# EasyEDA Pro project PocketTerminal_2025-09-03.epro, board PCB Rev1
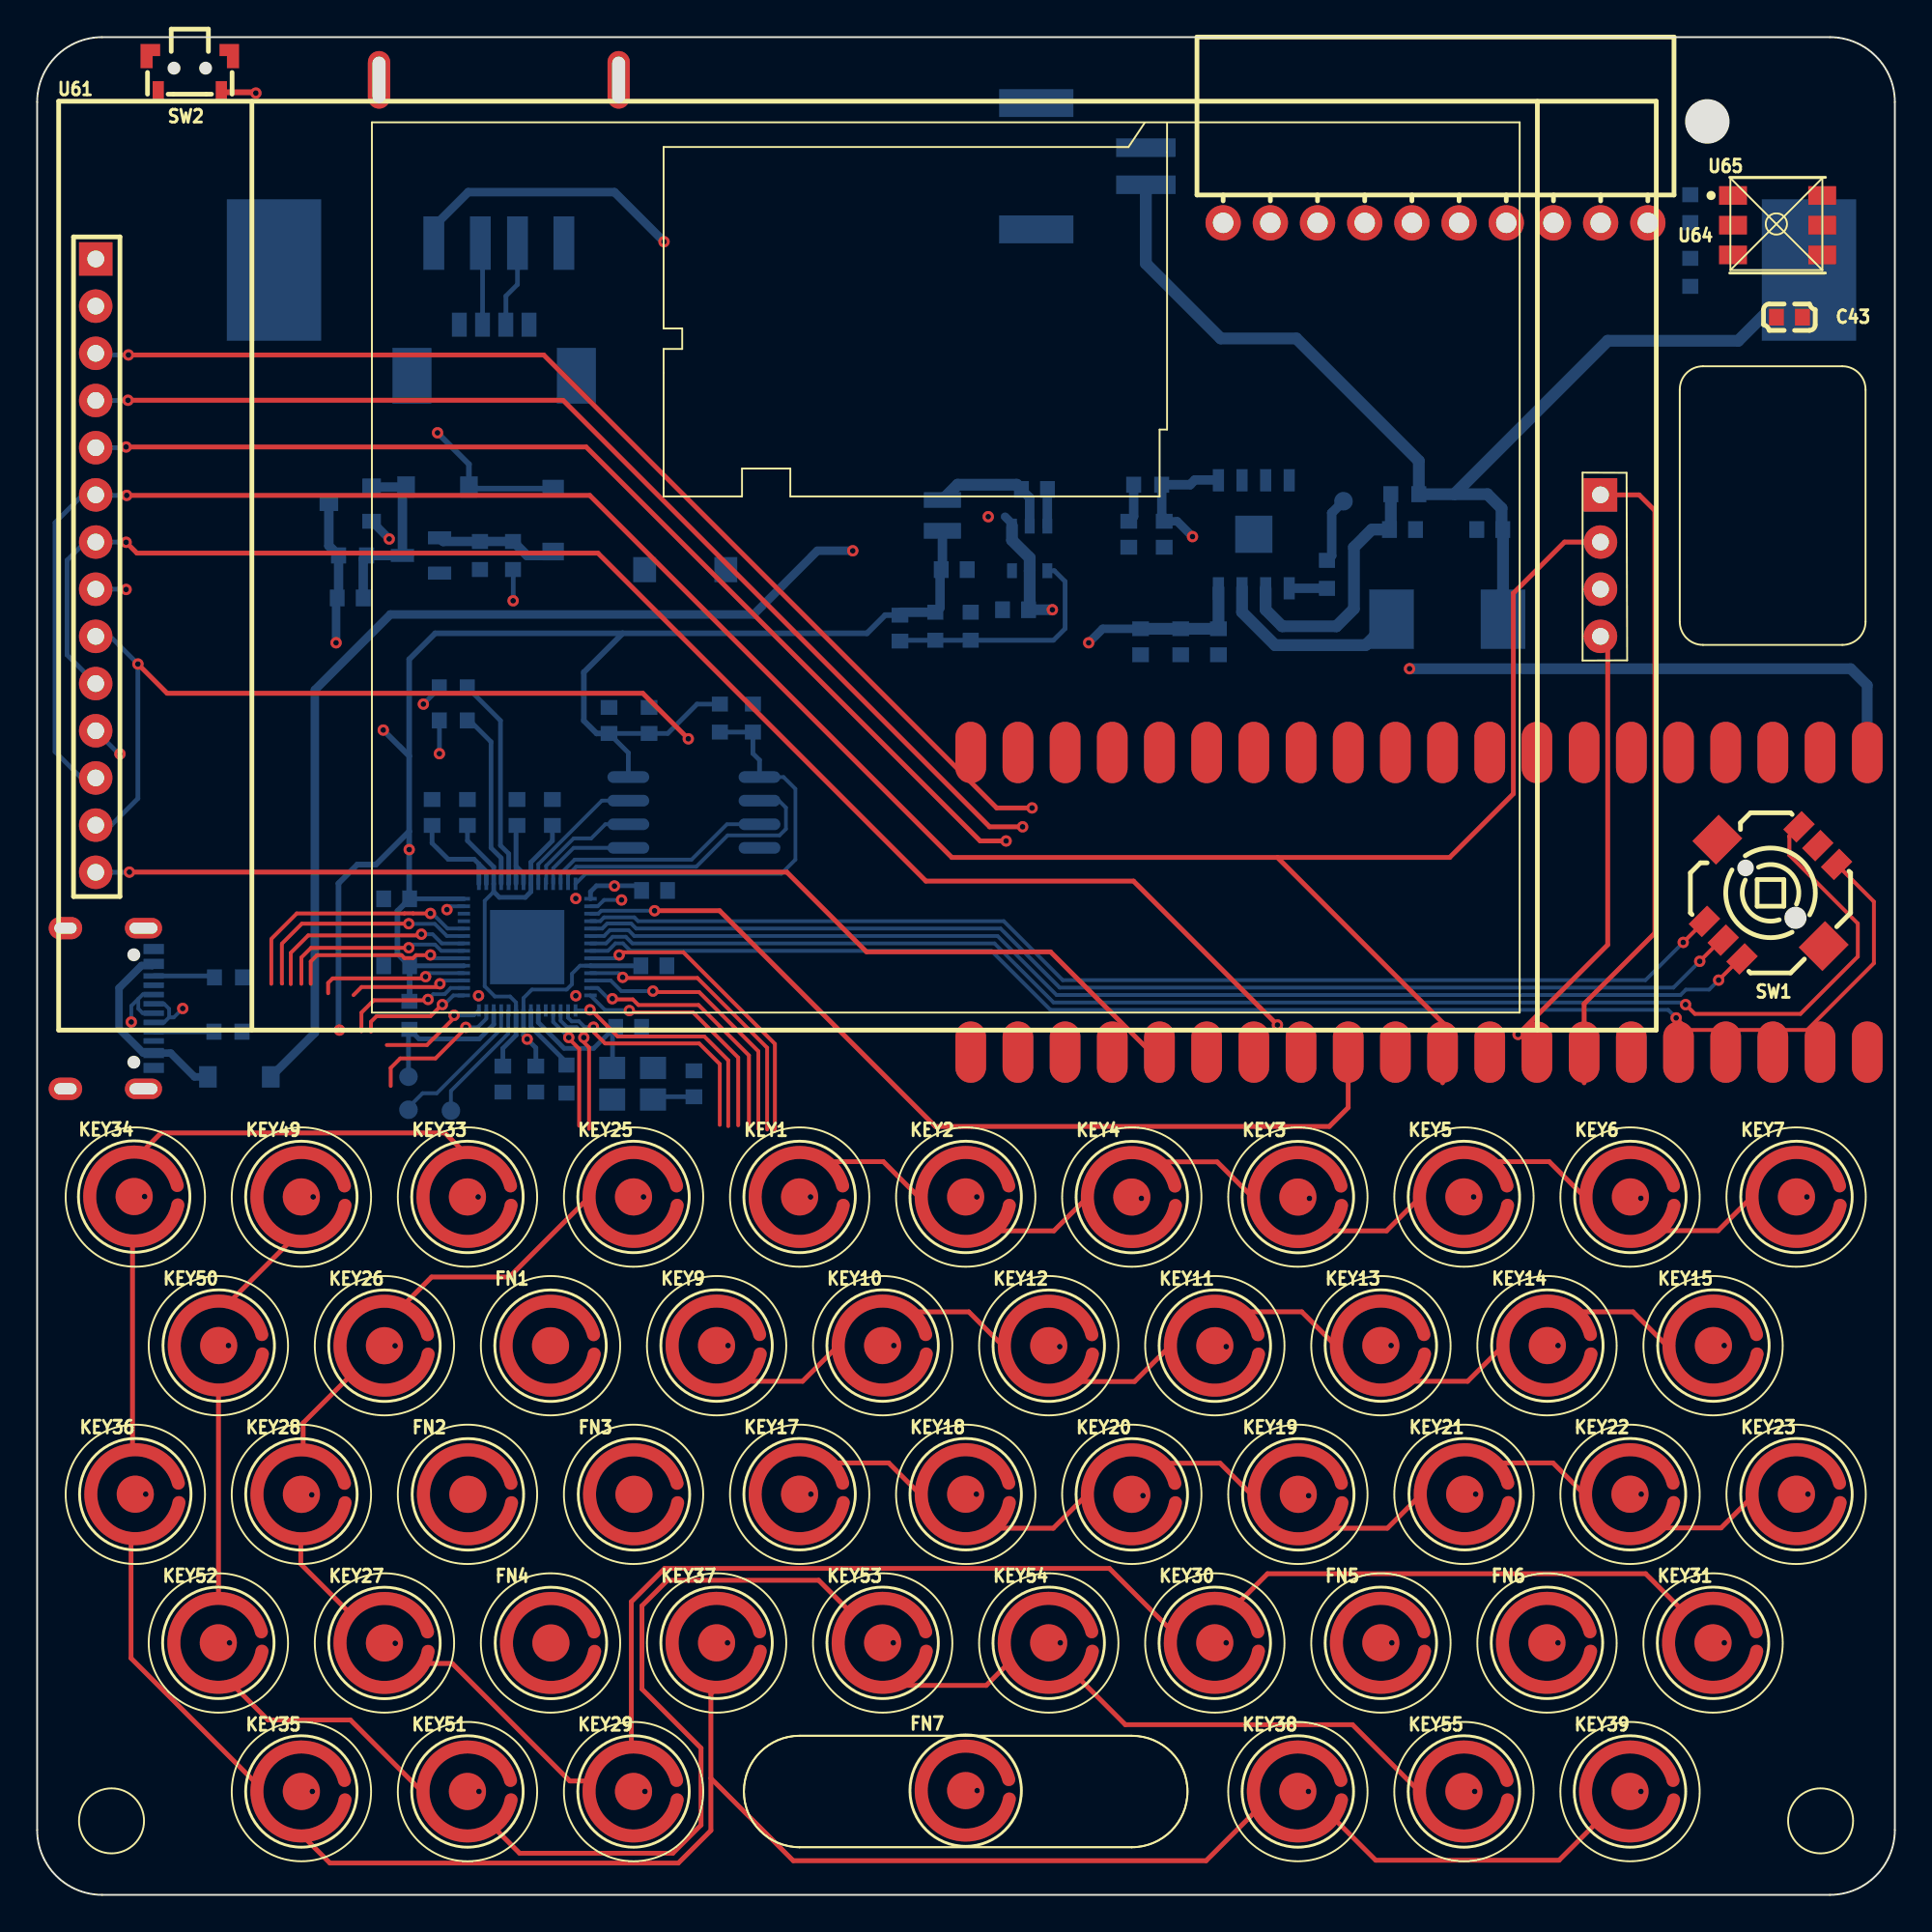
[diagram p1: board, top side]
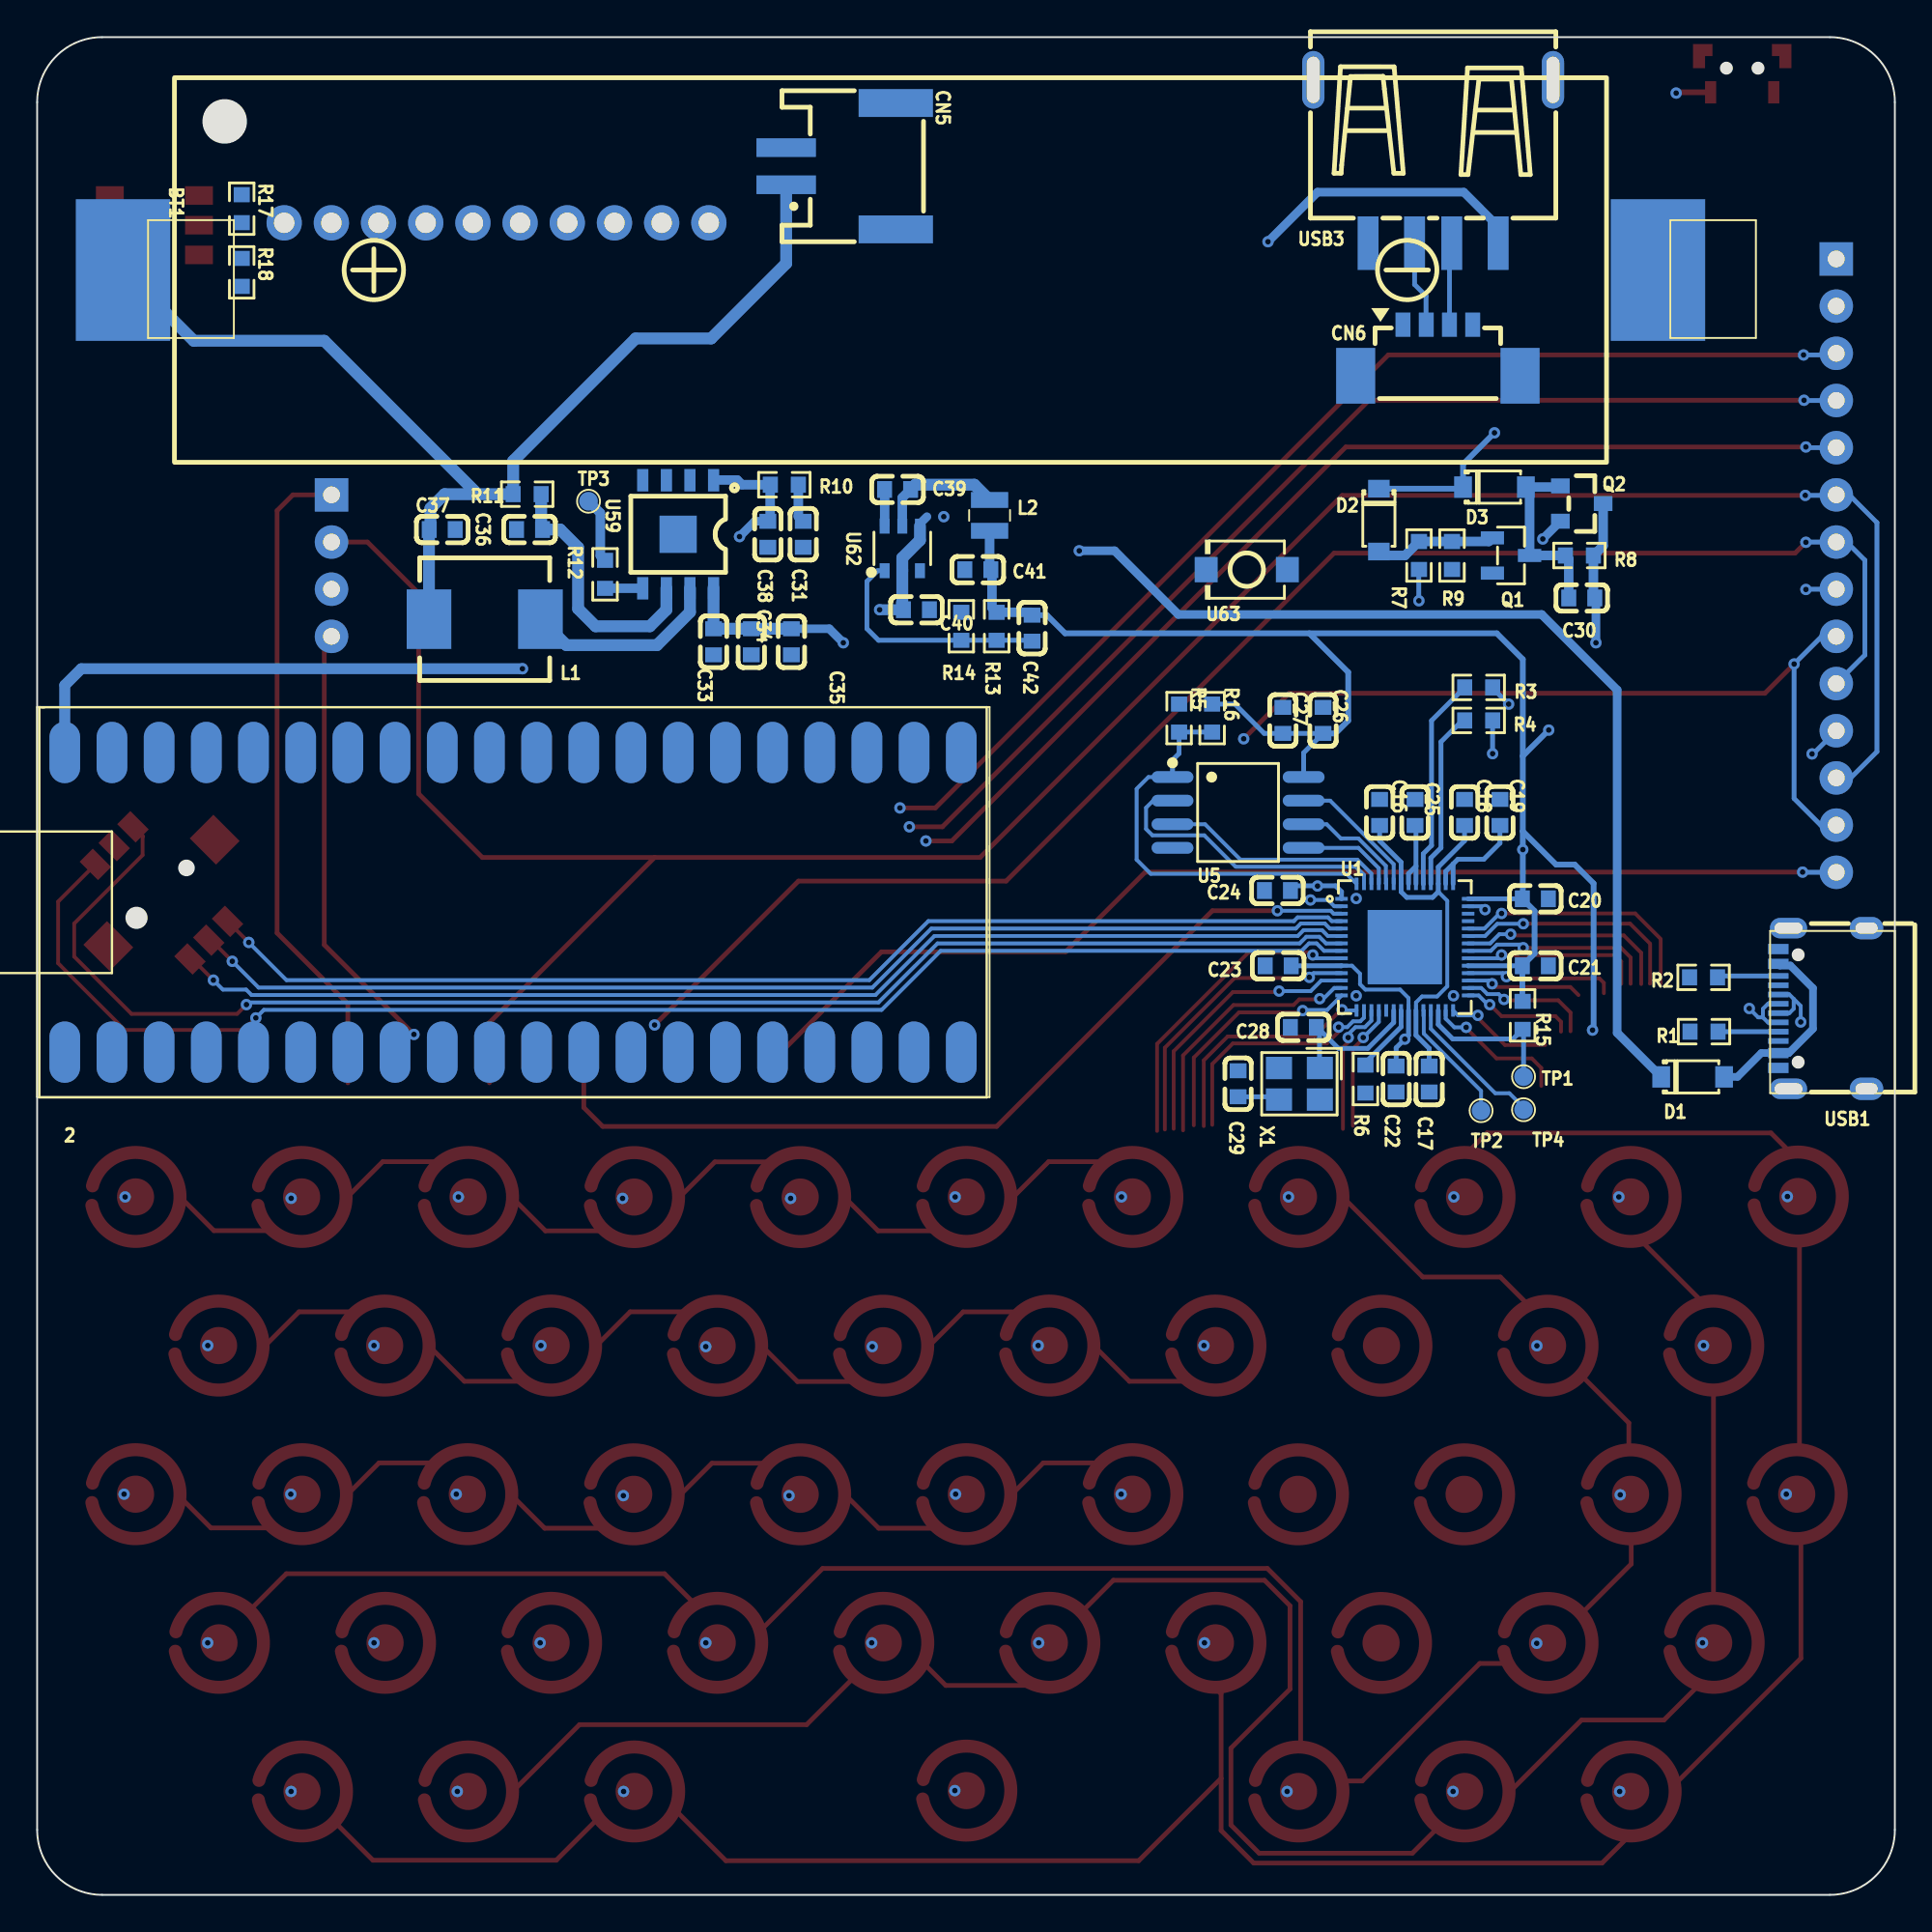
[diagram p2: board, bottom side, seen from below]

Outline 100 x 100 mm; copper layers: Top Layer, Inner1, Inner2, Bottom Layer. Coordinates in mm from the lower left corner of the outline.
Outline path: 0,96.5 0,3.5 arc(1.03,1.03) 3.5,0 96.5,0 arc(98.97,1.03) 100,3.5 100,96.5 arc(98.97,98.97) 96.5,100 3.5,100 arc(1.03,98.97) 0,96.5
Stack: Top Layer 0.035mm Outer layer thickness 1oz / Dielectric1 0.2104mm 7628 RC49% 8.6mil / Inner1 0.0152mm Inner layer thickness / Dielectric2 1.065mm 1.1mm H/HOZ Copper / Inner2 0.0152mm Inner layer thickness / Dielectric3 0.2104mm 7628 RC49% 8.6mil / Bottom Layer 0.035mm Outer layer thickness 1oz

## Design rules (mm)
template: JLCPCB Capability(Two Layers Board)
spacing copperThickness1oz (default): track to track 0.102, other pairs 0.152 to 0.3
spacing copperThickness2oz: track to track 0.203, other pairs 0.152 to 0.3
track width copperThickness1oz (default): min 0.127, default 0.254, max 2.54
track width copperThickness2oz: min 0.203, default 0.254, max 2.54
differential pair differentialPair (default): width min 0.127, default 0.254, max 2.54; gap min 0.152, default 0.152
via viaSize (default): diameter min 0.5, default 0.61, max 10; hole min 0.3, default 0.305, max 6.3

## Placement (name value [footprint] x y rotation side)
2  RASPBERRYPI-PICO  [RASPBERRYPIPICO]  98.51 44.54 180 bottom
BT1  BH-18650-B1BA002  [BATTERY-SMD_18650-1S-L77.1-W20.7-1]  54.06 87.47 90 bottom
C16  100nF  [C0603]  27.73 58.27 270 bottom
C17  100nF  [C0603]  25.07 43.91 90 bottom
C18  2.2uF  [C0603]  23.16 58.27 270 bottom
C19  2.2uF  [C0603]  21.26 58.27 270 bottom
C20  100nF  [C0603]  19.35 53.62 0 bottom
C21  100nF  [C0603]  19.35 50.01 0 bottom
C22  100nF  [C0603]  26.85 43.91 90 bottom
C23  100nF  [C0603]  33.2 50.01 180 bottom
C24  100nF  [C0603]  33.24 54.06 180 bottom
C25  100nF  [C0603]  25.83 58.27 270 bottom
C26  100nF  [C0603]  30.78 63.22 90 bottom
C27  2.2uF  [C0603]  32.94 63.22 90 bottom
C28  15pF  [C0603]  31.84 46.7 180 bottom
C29  15pF  [C0603]  35.35 43.66 270 bottom
C30  10nF  [C0603]  16.85 69.81 180 bottom
C31  10uF  [C0603]  58.76 73.24 90 bottom
C33  22uF  [C0603]  63.59 67.45 90 bottom
C34  22uF  [C0603]  61.56 67.45 90 bottom
C35  22uF  [C0603]  59.4 67.45 90 bottom
C36  22uF  [C0603]  73.5 73.5 180 bottom
C37  22uF  [C0603]  78.19 73.5 0 bottom
C38  10uF  [C0603]  60.67 73.24 270 bottom
C39  100nF  [C0603]  53.68 75.65 180 bottom
C40  10uF  [C0603]  52.67 69.18 0 bottom
C41  22uF  [C0603]  49.37 71.34 180 bottom
C42  47pF  [C0603]  46.44 68.19 90 bottom
C43  1nF  [C0603]  94.32 84.92 0 top
CN5  PH-2AWT  [CONN-SMD_PH-2AWT]  56.73 93.05 270 bottom
CN6  533980471  [CONN-SMD_4P-P1.25_533980471]  24.6 83.15 180 bottom
D1  LMBR120FT1G  [SOD-123_L2.8-W1.8-LS3.7-RD]  10.88 44.03 180 bottom
D2  LMBR120FT1G  [SOD-123_L2.8-W1.8-LS3.7-RD]  27.78 74 270 bottom
D3  LMBR120FT1G  [SOD-123_L2.8-W1.8-LS3.7-RD]  21.55 75.78 180 bottom
FN1  FN1  [KEY-SMD_BD5.0_600-508S-180]  26.44 29.52 0 top
FN2  FN2  [KEY-SMD_BD5.0_600-508S-180]  21.99 21.52 0 top
FN3  FN3  [KEY-SMD_BD5.0_600-508S-180]  30.93 21.52 0 top
FN4  FN4  [KEY-SMD_BD5.0_600-508S-180]  26.46 13.52 0 top
FN5  FN5  [KEY-SMD_BD5.0_600-508S-180]  71.14 13.53 0 top
FN6  FN6  [KEY-SMD_BD5.0_600-508S-180]  80.08 13.53 0 top
FN7  FN12  [KEY-SMD_BD5.0_600-508S-180]  48.79 5.57 0 top
KEY1  A1  [KEY-SMD_BD5.0_600-508S-180]  39.85 37.53 0 top
KEY2  B1  [KEY-SMD_BD5.0_600-508S-180]  48.79 37.53 0 top
KEY3  C1  [KEY-SMD_BD5.0_600-508S-180]  66.67 37.53 0 top
KEY4  D1  [KEY-SMD_BD5.0_600-508S-180]  57.73 37.53 0 top
KEY5  E1  [KEY-SMD_BD5.0_600-508S-180]  75.61 37.53 0 top
KEY6  F2  [KEY-SMD_BD5.0_600-508S-180]  84.57 37.53 0 top
KEY7  G1  [KEY-SMD_BD5.0_600-508S-180]  93.51 37.53 0 top
KEY9  A2  [KEY-SMD_BD5.0_600-508S-180]  35.38 29.53 0 top
KEY10  B1  [KEY-SMD_BD5.0_600-508S-180]  44.32 29.53 0 top
KEY11  C1  [KEY-SMD_BD5.0_600-508S-180]  62.2 29.52 0 top
KEY12  D1  [KEY-SMD_BD5.0_600-508S-180]  53.26 29.52 0 top
KEY13  E1  [KEY-SMD_BD5.0_600-508S-180]  71.14 29.53 0 top
KEY14  F2  [KEY-SMD_BD5.0_600-508S-180]  80.1 29.53 0 top
KEY15  G1  [KEY-SMD_BD5.0_600-508S-180]  89.04 29.53 0 top
KEY17  A3  [KEY-SMD_BD5.0_600-508S-180]  39.85 21.53 0 top
KEY18  B1  [KEY-SMD_BD5.0_600-508S-180]  48.79 21.53 0 top
KEY19  C1  [KEY-SMD_BD5.0_600-508S-180]  66.69 21.52 0 top
KEY20  D1  [KEY-SMD_BD5.0_600-508S-180]  57.73 21.52 0 top
KEY21  E1  [KEY-SMD_BD5.0_600-508S-180]  75.65 21.53 0 top
KEY22  F2  [KEY-SMD_BD5.0_600-508S-180]  84.55 21.53 0 top
KEY23  G1  [KEY-SMD_BD5.0_600-508S-180]  93.51 21.53 0 top
KEY25  A4  [KEY-SMD_BD5.0_600-508S-180]  30.91 37.53 0 top
KEY26  B1  [KEY-SMD_BD5.0_600-508S-180]  17.5 29.52 0 top
KEY27  C1  [KEY-SMD_BD5.0_600-508S-180]  17.5 13.52 0 top
KEY28  D1  [KEY-SMD_BD5.0_600-508S-180]  13.03 21.52 0 top
KEY29  E1  [KEY-SMD_BD5.0_600-508S-180]  30.91 5.53 0 top
KEY30  F2  [KEY-SMD_BD5.0_600-508S-180]  62.2 13.53 0 top
KEY31  G1  [KEY-SMD_BD5.0_600-508S-180]  89.02 13.53 0 top
KEY33  A5  [KEY-SMD_BD5.0_600-508S-180]  21.97 37.53 0 top
KEY34  B1  [KEY-SMD_BD5.0_600-508S-180]  4.03 37.55 0 top
KEY35  C1  [KEY-SMD_BD5.0_600-508S-180]  13.03 5.53 0 top
KEY36  D1  [KEY-SMD_BD5.0_600-508S-180]  4.09 21.53 0 top
KEY37  E1  [KEY-SMD_BD5.0_600-508S-180]  35.38 13.53 0 top
KEY38  F2  [KEY-SMD_BD5.0_600-508S-180]  66.67 5.53 0 top
KEY39  G1  [KEY-SMD_BD5.0_600-508S-180]  84.55 5.53 0 top
KEY49  A6  [KEY-SMD_BD5.0_600-508S-180]  13.03 37.53 0 top
KEY50  B1  [KEY-SMD_BD5.0_600-508S-180]  8.58 29.53 0 top
KEY51  C1  [KEY-SMD_BD5.0_600-508S-180]  21.97 5.53 0 top
KEY52  D1  [KEY-SMD_BD5.0_600-508S-180]  8.56 13.53 0 top
KEY53  E1  [KEY-SMD_BD5.0_600-508S-180]  44.32 13.53 0 top
KEY54  F2  [KEY-SMD_BD5.0_600-508S-180]  53.26 13.53 0 top
KEY55  G1  [KEY-SMD_BD5.0_600-508S-180]  75.61 5.53 0 top
L1  1uH  [IND-SMD_L7.0-W6.6]  75.91 68.67 0 bottom
L2  4.7uH  [IND-SMD_L2.5-W2.0-VLS252012CX-150M]  48.73 74.26 270 bottom
Q1  AO3400A  [SOT-23-3_L2.9-W1.3-P1.90-LS2.4-BR]  20.66 72.1 0 bottom
Q2  AO3401A  [SOT-23_L2.9-W1.3-P1.90-LS2.4-BR]  16.85 74.89 0 bottom
R1  5.1kΩ  [R0603]  10.27 46.47 180 bottom
R2  5.1kΩ  [R0603]  10.3 49.39 180 bottom
R3  27Ω  [R0603]  22.4 65 180 bottom
R4  27Ω  [R0603]  22.4 63.22 180 bottom
R5  1kΩ  [R0603]  38.53 63.35 270 bottom
R6  1kΩ  [R0603]  28.5 43.91 90 bottom
R7  330Ω  [R0603]  25.62 72.1 90 bottom
R8  100kΩ  [R0603]  16.98 72.1 180 bottom
R9  1MΩ  [R0603]  23.84 72.1 90 bottom
R10  2Ω  [R0603]  59.78 75.91 0 bottom
R11  500mΩ  [R0603]  73.62 75.4 0 bottom
R12  10kΩ  [R0603]  69.43 71.08 270 bottom
R13  100kΩ  [R0603]  48.35 68.29 270 bottom
R14  22.1kΩ  [R0603]  50.25 68.29 270 bottom
R15  10kΩ  [R0603]  20.04 47.34 90 bottom
R16  10kΩ  [R0603]  36.75 63.35 270 bottom
R17  220Ω  [R0603]  88.99 90.77 270 bottom
R18  220Ω  [R0603]  88.99 87.34 270 bottom
SW1  SKRHABE010  [SW-SMD_SKRHABE010]  93.31 53.94 45 top
SW2  TS24CA  [SW-SMD_TS24CA]  8.22 98.01 0 top
TP1  RST  [TestPoint_1mm]  19.99 44.04 180 bottom
TP2  swclk  [TestPoint_1mm]  22.27 42.21 180 bottom
TP3  key  [TestPoint_1mm]  70.32 75.02 180 bottom
TP4  swd  [TestPoint_1mm]  19.99 42.26 180 bottom
U1  RP2040  [QFN-56_L7.0-W7.0-P0.40-TL-EP4.0]  26.38 51.02 180 bottom
U5  W25Q32JVSSIQ  [SOIC-8_L5.3-W5.3-P1.27-LS8.0-BL]  35.35 58.27 270 bottom
U59  IP5306-I2C  [ESOP-8_L4.9-W3.9-P1.27-LS6.0-BL-EP2.0]  65.49 73.24 0 bottom
U61  ILI9341 TFT 2.8"  [ILI9341-2.8]  1.16 96.55 0 top
U62  SY8105ADC  [TSOT-23-6_L2.9-W1.6-P0.95-LS2.8-BR]  53.43 72.48 270 bottom
U63  Boot  [SW-SMD_L3.9-W3.0-P4.45]  34.89 71.34 0 bottom
U64  PM254-1-10-W-8.5  [HDR-TH_10P-P2.54-H-F-W10.0-N]  75.27 90 180 top
U65  SK9822  [SMD_6P-L5.0-W5.0-TL]  93.69 89.88 0 top
USB1  TYPE-C 16PIN 2MD(073)  [USB-C-SMD_TYPE-C-6PIN-2MD-073]  3.9 47.71 90 bottom
USB3  10.0 QHHTZB6.3  [USB-A-TH_10.0QHHTZB6.3]  24.85 93.31 0 bottom
X1  12MHz  [CRYSTAL-SMD_4P-L3.2-W2.5-BL]  32.05 43.66 0 bottom

## Footprints (pads in the part's own frame, mm; a bottom-side part is the same pattern mirrored in y, then rotated)
BATTERY-SMD_18650-1S-L77.1-W20.7-1
  rect 7.62x5.08 smd: 1(0,-41.313) 2(0,41.313)
C0603
  rect 0.8x0.9 smd: 1(-0.7,0) 2(0.7,0)
CONN-SMD_4P-P1.25_533980471
  rect 0.8x1.3 smd: 1(-1.875,1.375) 2(-0.625,1.375) 3(0.625,1.375) 4(1.875,1.375)
  rect 2.1x3 smd: 5(4.425,-1.375) 6(-4.425,-1.375)
CONN-SMD_PH-2AWT
  rect 1x3.2 smd: 1(1,-2.95) 2(-1,-2.95)
  rect 1.5x4 smd: 3(-3.4,2.95) 4(3.4,2.95)
CRYSTAL-SMD_4P-L3.2-W2.5-BL
  rect 1.4x1.2 smd: 1(-1.1,-0.85) 2(1.1,-0.85) 3(1.1,0.85) 4(-1.1,0.85)
ESOP-8_L4.9-W3.9-P1.27-LS6.0-BL-EP2.0
  rect 0.6x1.2 smd: 1(-1.905,-2.909) 2(-0.635,-2.909) 3(0.635,-2.909) 4(1.905,-2.909) 5(1.905,2.909) 6(0.635,2.909) 7(-0.635,2.909) 8(-1.905,2.909)
  rect 2x2 smd: 9(0,0)
HDR-TH_10P-P2.54-H-F-W10.0-N
  round 1.9 hole 1.1: 1(-11.43,0) 2(-8.89,0) 3(-6.35,0) 4(-3.81,0) 5(-1.27,0) 6(1.27,0) 7(3.81,0) 8(6.35,0) 9(8.89,0) 10(11.43,0)
ILI9341-2.8
  rect 1.8x1.8 hole 0.905x0.9: 1(1.996,-8.489) 15(82.997,-21.189)
  round 1.8 hole 0.905x0.9: 2(1.994,-11.028) 3(1.994,-13.569) 4(1.994,-16.108) 5(1.994,-18.648) 6(1.994,-21.189) 7(1.994,-23.729) 8(1.994,-26.266) 9(1.994,-28.806) 10(1.994,-31.346) 11(1.994,-33.886) 12(1.994,-36.426) 13(1.994,-38.966) 14(1.994,-41.506) 16(82.997,-23.729) 17(82.997,-26.266) 18(82.997,-28.806)
IND-SMD_L2.5-W2.0-VLS252012CX-150M
  rect 0.85x2 smd: 1(-0.83,0) 2(0.83,0)
IND-SMD_L7.0-W6.6
  rect 2.4x3.2 smd: 1(-3,0) 2(3,0)
KEY-SMD_BD5.0_600-508S-180
  round 2 smd: 1(1.196,0.036)
  custom 5.444x5.487 smd: 2(-1.196,-0.036)
QFN-56_L7.0-W7.0-P0.40-TL-EP4.0
  rect 0.665x0.2 smd: 1(-3.408,2.6) 2(-3.408,2.2) 3(-3.408,1.8) 4(-3.408,1.4) 5(-3.408,1) 6(-3.408,0.6) 7(-3.408,0.2) 8(-3.408,-0.2) 9(-3.408,-0.6) 10(-3.408,-1) 11(-3.408,-1.4) 12(-3.408,-1.8) 13(-3.408,-2.2) 14(-3.408,-2.6) 29(3.408,-2.6) 30(3.408,-2.2) 31(3.408,-1.8) 32(3.408,-1.4) 33(3.408,-1) 34(3.408,-0.6) 35(3.408,-0.2) 36(3.408,0.2) 37(3.408,0.6) 38(3.408,1) 39(3.408,1.4) 40(3.408,1.8) 41(3.408,2.2) 42(3.408,2.6)
  rect 0.2x0.665 smd: 15(-2.6,-3.408) 16(-2.2,-3.408) 17(-1.8,-3.408) 18(-1.4,-3.408) 19(-1,-3.408) 20(-0.6,-3.408) 21(-0.2,-3.408) 22(0.2,-3.408) 23(0.6,-3.408) 24(1,-3.408) 25(1.4,-3.408) 26(1.8,-3.408) 27(2.2,-3.408) 28(2.6,-3.408) 43(2.6,3.408) 44(2.2,3.408) 45(1.8,3.408) 46(1.4,3.408) 47(1,3.408) 48(0.6,3.408) 49(0.2,3.408) 50(-0.2,3.408) 51(-0.6,3.408) 52(-1,3.408) 53(-1.4,3.408) 54(-1.8,3.408) 55(-2.2,3.408) 56(-2.6,3.408)
  rect 4x4 smd: 57(0,0)
R0603
  rect 0.806x0.864 smd: 1(-0.753,0) 2(0.753,0)
RASPBERRYPIPICO
  custom 1.65x3.297 hole 1.1: 3V3(OUT)(10.16,17.78) 3V3_EN(7.62,17.78) ADC_VREF(12.7,17.78) GND(5.08,0) GND1(17.78,0) GND2(30.48,0) GND3(43.18,0) GND4(5.08,17.78) GND5(17.78,17.78) GND6(30.48,17.78) GND7(43.18,17.78) GP0(0,0) GP1(2.54,0) GP2(7.62,0) GP3(10.16,0) GP4(12.7,0) GP5(15.24,0) GP6(20.32,0) GP7(22.86,0) GP8(25.4,0) GP9(27.94,0) GP10(33.02,0) GP11(35.56,0) GP12(38.1,0) GP13(40.64,0) GP14(45.72,0) GP15(48.26,0) GP16(48.26,17.78) GP17(45.72,17.78) GP18(40.64,17.78) GP19(38.1,17.78) GP20(35.56,17.78) GP21(33.02,17.78) GP22(27.94,17.78) GP26(22.86,17.78) GP27(20.32,17.78) GP28(15.24,17.78) RUN(25.4,17.78) VBUS(0,17.78) VSYS(2.54,17.78)
SMD_6P-L5.0-W5.0-TL
  rect 1.5x1 smd: 1(-2.4,1.6) 2(-2.4,0) 3(-2.4,-1.6) 4(2.4,-1.6) 5(2.4,0) 6(2.4,1.6)
SOD-123_L2.8-W1.8-LS3.7-RD
  rect 0.95x1.15 smd: 1(-1.692,0) 2(1.692,0)
SOIC-8_L5.3-W5.3-P1.27-LS8.0-BL
  oval 0.63x2.25 smd: 1(-1.905,-3.53) 2(-0.635,-3.53) 3(0.635,-3.53) 4(1.905,-3.53) 5(1.905,3.53) 6(0.635,3.53) 7(-0.635,3.53) 8(-1.905,3.53)
SOT-23-3_L2.9-W1.3-P1.90-LS2.4-BR
  rect 1.25x0.7 smd: 1(1,-0.95) 2(1,0.95) 3(-1,0)
SOT-23_L2.9-W1.3-P1.90-LS2.4-BR
  rect 1x0.8 smd: 1(1.15,-0.95) 2(1.15,0.95) 3(-1.15,0)
SW-SMD_L3.9-W3.0-P4.45
  rect 1.23x1.36 smd: 1(-2.185,0) 2(2.185,0)
SW-SMD_SKRHABE010
  rect 1.4x1 smd: 1(-3.6,1.43) 2(-3.6,0) 3(-3.6,-1.43) 4(3.6,1.43) 5(3.599,0) 6(3.6,-1.43)
  rect 2x1.8 smd: 7(-0.001,4.05) 8(-0.001,-4.05)
SW-SMD_TS24CA
  custom 1.05x1.3 smd: 1(-2.125,0.975) 2(2.125,0.975)
  rect 0.6x1.2 smd: 3(-1.7,-0.975) 4(1.7,-0.975)
TestPoint_1mm
  round 1 smd: 1(0,0)
TSOT-23-6_L2.9-W1.6-P0.95-LS2.8-BR
  rect 0.8x0.532 smd: 1(1.2,-0.95) 2(1.2,0) 3(1.2,0.95) 4(-1.2,0.95) 5(-1.2,0) 6(-1.2,-0.95)
USB-A-TH_10.0QHHTZB6.3
  rect 1.12x2.88 smd: 1(-3.5,4.395) 2(-1,4.395) 3(1,4.395) 4(3.5,4.395)
  oval 1.2x3.1 hole 0.7x2.5: 5(-6.45,-4.395) 6(6.45,-4.395)
USB-C-SMD_TYPE-C-6PIN-2MD-073
  rect 0.55x1.1 smd: 1(-3.2,2.375) 2(-2.4,2.375) 11(2.4,2.375) 12(3.2,2.375)
  rect 0.3x1.1 smd: 3(-1.75,2.375) 4(-1.25,2.375) 5(-0.75,2.375) 6(-0.25,2.375) 7(0.25,2.375) 8(0.75,2.375) 9(1.25,2.375) 10(1.75,2.375)
  oval 1.2x1.8 hole 0.6x1.2: 13(-4.325,-2.375) 14(4.325,-2.375)
  oval 1.1x2 hole 0.6x1.5: 13(-4.325,1.825) 14(4.325,1.825)

## Nets
As in the schematic.

Pads without a net: 2 3V3(OUT) 3V3_EN ADC_VREF GP0 GP1 GP16 GP17 GP18 GP19 GP20 GP21 GP22 GP26 GP27 GP28 RUN VSYS; CN6 1; U1 39 40; U59 2 3 4; U64 1 2 3 4 5 6 7 8 9 10; U65 5 6; USB1 3 9

## Via types
v1: diameter 0.61, hole 0.305, Top Layer to Bottom Layer, 112 vias

## Routing (per net, layer and track width the routed paths; a pad name or vN(x,y) marks a point on that pad's centre or on a via; arc(x,y) is an arc through that point)
+1.1V: length 21.4
  Bottom Layer w0.203: 24.58,54 24.09,53.51 24.09,48.91 24.64,48.36 25.45,48.36 25.78,48.04 U1.23
  Bottom Layer w0.254: C18.2 23.16,56.74 24.58,55.33 U1.45 24.58,54 24.88,53.69 26.28,53.69 26.58,54 U1.50 26.58,55.58 27.73,56.74 C16.2 ; U1.23 25.78,46.28 25.07,45.57 25.07,44.74
+3V3: length 172
  Inner2 w0.254: v1(26.38,46.06) 26,45.68 22.19,45.68 21.68,45.17 17.65,45.17 v1(16.27,46.55) ; v1(20.03,56.27) 29.51,56.27 31.08,54.7 v1(31.08,54.31)
  Inner2 w0.305: v1(18.63,62.7) 8.72,72.61 8.72,85.43 6.1,88.06 U61.1
  Bottom Layer w0.203: U1.22 26.18,48.28 26.63,48.73 28.5,48.73 28.79,49.02 28.79,49.59 29.22,50.02 U1.10
  Bottom Layer w0.254: C20.2 22.97,53.62 ; C21.2 22.97,50.01 U1.33 ; U5.8 31.82,61.48 C26.1 C27.1 33.94,62.52 35.52,64.1 36.75,64.1 R16.1 ; 23.78,55.49 24.18,55.09 U1.44 ; 23.78,55.49 U1.43 ; 23.78,55.49 23.52,55.75 22.13,55.75 21.26,56.61 C19.2 ; U1.49 26.18,54.97 25.78,55.37 ; C22.2 26.85,45.6 26.18,46.26 U1.22 ; C23.2 29.79,50.01 U1.10 ; C25.2 25.78,57.51 25.78,55.37 ; U1.48 25.78,55.37 ; 32.54,53.94 32.54,54.13 32.35,54.32 30.11,54.32 29.79,54 U1.1
  Bottom Layer w0.305: 31.52,67.91 44.67,67.91 45.65,68.89 C42.2 ; 31.52,67.91 29.43,65.81 29.43,63.21 30.12,62.52 C26.1 ; 31.52,67.91 21.42,67.91 20.03,66.51 20.03,61.3 ; 20.03,57.25 v1(20.03,56.27) 20.03,53.64 C20.2 19.39,52.96 19.39,50.67 C21.2 20.05,48.11 20.04,48.1 ; 20.03,57.25 20.03,61.3 ; 20.03,57.25 18.24,55.46 17.23,55.46 16.22,54.44 16.22,46.57 ; 20.03,61.3 v1(18.63,62.7)
  Bottom Layer w0.508: 48.66,71.34 48.6,71.27 48.6,69.3 R13.1 46.5,69.04 46.44,68.99 ; L2.2 48.73,71.4
+5V: length 120.4
  Inner2 w0.457: v1(33.74,88.99) 33.74,77.08 36.64,74.19 ; 36.64,74.19 v1(51.2,74.19) ; 36.64,74.19 20.15,74.19 v1(18.95,72.99)
  Inner2 w0.584: v1(54.65,69.18) 57.87,69.18 61.05,66 v1(73.88,66)
  Bottom Layer w0.457: Q2.2 18.95,72.99 v1(18.95,72.99) ; USB3.1 21.35,89.81 23.2,91.66 31.08,91.66 v1(33.74,88.99) ; 52.1,74.19 52.48,73.81 U62.4
  Bottom Layer w0.584: v1(73.88,66) 97.62,66 98.51,65.11 2.VBUS ; v1(54.65,69.18) C40.2
  Bottom Layer w0.635: U62.4 52.48,72.92 53.43,71.97 U62.2 53.43,69.24
GND:
  vias: v1(23.76,48.4) v1(29,53.63) v1(29,48.4)
VBUS: length 10.5
  Bottom Layer w0.406: USB1.11 6.19,50.03 5.62,50.03 4.41,48.81 4.41,46.62 5.71,45.31 USB1.2 7.19,45.31 8.47,44.03 D1.2
1: length 51
  Top Layer w0.203: 31.37,50.62 31.48,50.74 34.78,50.74 39.71,45.81 39.71,41.12
  Top Layer w0.254: 56.48,37.49 54.73,35.74 51.27,35.74 ; 69.37,35.74 72.64,35.74 74.42,37.52 ; 47.56,37.46 45.55,39.47 42.91,39.47 ; 87.2,35.75 90.49,35.75 92.24,37.5 ; 78.54,39.47 81.4,39.47 83.4,37.46 ; 65.44,37.53 63.52,39.45 60.62,39.45
  Bottom Layer w0.203: U1.9 31.15,50.42 v1(31.33,50.59)
2: length 50.2
  Top Layer w0.203: 31.52,49.35 35.54,49.35 39.3,45.6 39.3,41.2
  Top Layer w0.254: 60.95,29.51 59.07,27.63 55.91,27.63 ; 87.82,29.46 85.9,31.38 83.04,31.38 ; 69.95,29.51 68.07,31.38 64.96,31.38 ; 78.84,29.48 77,27.64 73.72,27.64 ; 37.91,27.64 41.2,27.64 43.08,29.52 ; 52.03,29.5 50.15,31.38 47.1,31.38
  Bottom Layer w0.203: U1.11 31.29,49.62 v1(31.52,49.39)
3: length 48.2
  Top Layer w0.203: 38.82,41.24 38.82,45.41 35.64,48.6 33.15,48.6
  Top Layer w0.254: 65.43,21.49 63.68,23.23 60.61,23.23 ; 78.61,23.25 81.6,23.25 83.39,21.46 ; 69.57,19.74 72.68,19.74 74.43,21.49 ; 43.15,23.25 45.84,23.25 47.59,21.5 ; 51.35,19.74 54.7,19.74 56.5,21.53 ; 92.35,21.46 90.65,19.75 87.32,19.75
  Bottom Layer w0.203: U1.12 30.88,49.22 31.44,48.65 v1(33.15,48.65)
4: length 112.1
  Top Layer w0.203: 38.32,41.15 38.32,45.19 35.6,47.9 32.37,47.9 32.06,48.2 31.02,48.2
  Top Layer w0.254: 64.69,15.62 64.69,15.75 66.23,17.29 86.59,17.29 88.51,15.37 ; 16.71,15.29 14.19,17.81 14.19,19.13 ; 31.99,8.01 31.99,15.78 33.78,17.57 57.72,17.57 61.13,14.16 ; 29.61,6.11 29.59,6.13 28.67,6.13 22.35,12.46 20.8,12.46 ; 16.92,28.01 14.32,25.41 14.32,24.04 ; 29.72,37.57 25.41,33.26 21.23,33.26 19.78,31.81
  Bottom Layer w0.203: U1.13 30.18,48.82 30.75,48.24 v1(30.96,48.24)
5: length 137.6
  Top Layer w0.203: 32,47.5 35.3,47.5 37.74,45.07 37.74,41.43
  Top Layer w0.254: 5.65,39.99 6.67,41.01 21.95,41.01 23.01,39.95 ; 69.74,4.18 72.06,1.86 81.92,1.86 83.95,3.89 ; 5.06,19.16 5.06,12.74 11.73,6.06 ; 65.69,4.6 62.92,1.84 40.7,1.84 36.27,6.27 ; 36.27,6.27 36.27,3.47 34.51,1.71 15.76,1.71 14.42,3.06 ; 36.27,6.27 36.27,10.83 36.69,11.25 ; 5.13,35.12 5.13,23.99 5.2,23.92
  Bottom Layer w0.203: U1.14 29.79,48.41 30.56,47.63 31.85,47.63 v1(31.88,47.6)
6: length 93.9
  Top Layer w0.254: 46.42,11.27 51.09,11.27 52.31,12.49 ; 10.37,31.92 13.67,35.22 ; 9.74,27.25 9.76,27.23 9.76,16.04 9.7,15.98 ; 20.73,5.54 16.87,9.41 12.43,9.41 10.55,11.29 ; 43.7,15.31 42.07,16.93 33.93,16.93 32.56,15.56 32.56,11.08 35.74,7.9 35.74,3.76 34.22,2.24 25.97,2.24 24.49,3.72 ; 74.39,5.58 70.8,9.16 58.58,9.16 55.95,11.78
A: length 59.3
  Top Layer w0.203: 29.83,47.62 31.25,46.21 35.91,46.21 37.2,44.92 37.2,41.38
  Inner2 w0.254: v1(41.65,21.57) 41.65,25.11 v1(37.19,29.57) 32.64,34.12 v1(32.64,37.57) ; v1(32.64,37.57) v1(23.74,37.57) v1(14.86,37.57) ; v1(32.64,37.57) v1(41.63,37.57)
  Bottom Layer w0.203: v1(29.76,47.64) 29.72,47.61 U1.15
B: length 88.3
  Top Layer w0.203: 29.97,46.77 29.97,46.43 30.57,45.83 35.64,45.83 36.75,44.72 36.75,41.45
  Inner2 w0.254: v1(5.78,37.59) 5.78,34.08 v1(10.3,29.57) 19.26,29.57 v1(19.27,29.56) 22.44,29.56 26.38,25.62 34.25,25.62 40.86,19.01 48,19.01 v1(50.56,21.57) 46.12,26.01 v1(46.12,29.57) 50.58,34.04 v1(50.58,37.57)
  Bottom Layer w0.203: U1.16 28.58,47.22 28.77,47.02 29.16,47.02 29.48,46.71 v1(29.94,46.71)
BAT: length 60
  Bottom Layer w0.635: 78.91,73.48 L1.2 ; BT1.2 91.57,83.66 84.54,83.66 76.29,75.4 ; 76.29,75.4 78.07,75.4 78.83,74.64 78.83,73.56 C37.2 ; 76.29,75.4 R11.2 74.38,77.19 67.78,83.78 63.72,83.78 59.68,87.82 CN5.1
BFB: length 12.8
  Bottom Layer w0.254: 46.5,67.53 R13.2 R14.2 54.71,67.53 55.33,68.16 55.33,70.7 54.76,71.28 U62.1
C: length 96.9
  Top Layer w0.203: 29.35,45.97 29.71,45.61 29.71,41.23
  Inner2 w0.254: v1(68.49,37.49) 64.01,33.01 v1(64.01,29.51) 68.44,25.07 v1(68.44,21.49) 64.19,17.23 36.92,17.23 25.25,5.57 v1(23.78,5.57) ; v1(23.78,5.57) 23.78,9.04 v1(19.28,13.54) ; v1(23.78,5.57) v1(14.81,5.57)
  Bottom Layer w0.203: U1.17 28.18,47.06 28.53,46.71 29.03,46.71 29.43,46.32 v1(29.43,46.15)
CC1: length 3.2
  Bottom Layer w0.254: USB1.4 9.52,46.46
CC2: length 3.4
  Bottom Layer w0.254: USB1.10 9.72,49.46
D: length 96.6
  Top Layer w0.203: 28.57,46.14 29.18,45.54 29.18,41.4
  Inner2 w0.254: v1(59.44,37.49) 55.05,33.1 v1(55.05,29.51) 59.53,25.03 v1(59.53,21.49) 56.16,18.12 23.97,18.12 19.27,22.82 16.15,22.82 14.82,21.5 ; v1(10.35,13.57) 13.19,13.57 16.09,16.47 16.09,20.23 14.82,21.5 ; 14.82,21.5 v1(14.78,21.53) 14.75,21.57 v1(5.84,21.57)
  Bottom Layer w0.203: v1(28.62,46.15) 27.78,46.99 U1.18
E: length 80.8
  Top Layer w0.203: 23.07,46.66 21.44,45.03 19.54,45.03 19.03,44.51 19.03,43.55
  Inner2 w0.254: v1(77.32,37.57) 72.88,33.13 v1(72.88,29.57) 77.44,25.01 v1(77.44,21.57) 72.21,16.34 53.68,16.34 50.9,13.57 v1(46.09,13.57) v1(37.16,13.57) 32.72,9.12 v1(32.72,5.57)
  Bottom Layer w0.203: v1(23.08,46.7) 23.71,46.7 24.18,47.17 U1.27
F: length 73.6
  Top Layer w0.203: 18.82,45.75 20.98,45.75 22.39,47.15
  Inner2 w0.254: v1(55.08,13.57) v1(64,13.57) 68.43,9.14 v1(68.43,5.57) 72.24,5.57 79.08,12.41 79.08,18.25 82.4,21.57 v1(86.35,21.57) 86.35,21.57 87.08,22.31 87.08,24.35 v1(81.87,29.57) 81.87,34.88 84.49,37.5 v1(86.33,37.5)
  Bottom Layer w0.203: v1(22.44,47.34) 23.51,47.34 U1.28
FN1: length 6.2
  Top Layer w0.203: 17.03,48.43 17.46,48.87 21.65,48.87 21.71,48.93
  Bottom Layer w0.203: v1(21.68,49.04) 21.85,49.22 U1.31
FN2: length 8.1
  Top Layer w0.203: 20.95,49.33 15.9,49.33 15.66,49.09 15.66,48.54
  Bottom Layer w0.203: v1(20.91,49.43) 21.1,49.62 U1.32
FN3: length 9.8
  Top Layer w0.203: 21.16,50.58 20.4,50.58 20.24,50.42 19.78,50.42 19.62,50.58 15.07,50.58 14.73,50.24 14.73,49.04
  Bottom Layer w0.203: U1.34 21.35,50.42 v1(21.17,50.59)
FN4: length 10.6
  Top Layer w0.203: 14.22,49.04 14.22,50.46 14.74,50.98 20.01,50.98
  Bottom Layer w0.203: v1(20.01,50.98) 20.18,51.15 21.42,51.15 21.75,50.82 U1.35
FN5: length 11.4
  Top Layer w0.203: 20.52,51.65 14.59,51.65 13.65,50.71 13.65,49.03
  Bottom Layer w0.203: U1.36 21.78,51.22 21.29,51.71 v1(20.68,51.71)
  vias: v1(72.92,13.57)
FN6: length 12.6
  Top Layer w0.203: 13.17,51.19 13.17,49.07 13.19,49.05 ; 13.19,51.22 14.25,52.28 19.96,52.28
  Bottom Layer w0.203: v1(20,52.28) 20.01,52.27 21.4,52.27 22.06,51.62 U1.37
  vias: v1(81.87,13.57)
FN7: length 62.8
  Top Layer w0.203: SW1.1 89.74,52.4 v1(88.61,51.27)
  Bottom Layer w0.203: U1.4 30.31,52.42 30.52,52.62 32.15,52.62 32.35,52.42 52.03,52.42 55.21,49.24 86.58,49.24 v1(88.61,51.27)
FN8: length 63.6
  Top Layer w0.203: v1(89.5,50.25) 90.63,51.39 SW1.2
  Bottom Layer w0.203: U1.5 30.42,52.02 30.69,52.29 31.98,52.29 32.25,52.02 51.86,52.02 55.04,48.84 88.08,48.84 v1(89.5,50.25)
FN9: length 64.4
  Top Layer w0.203: v1(90.51,49.24) 91.65,50.38 SW1.3
  Bottom Layer w0.203: U1.6 30.52,51.62 30.83,51.93 31.83,51.93 32.14,51.62 51.7,51.62 54.88,48.44 88.46,48.44 88.75,48.73 90,48.73 v1(90.51,49.24)
FN10: length 80.1
  Top Layer w0.203: 94.32,56.98 94.32,55.97 98.01,52.29 98.01,50.51 94.92,47.42 89.23,47.42 v1(88.74,47.92)
  Top Layer w0.254: SW1.4 94.32,56.98
  Bottom Layer w0.203: U1.7 30.62,51.22 30.98,51.57 31.68,51.57 32.04,51.22 51.53,51.22 54.71,48.04 88.62,48.04 v1(88.74,47.92)
FN11: length 78.8
  Top Layer w0.203: v1(88.23,47.21) 88.88,46.56 95.28,46.56 98.87,50.15 98.87,53.46 SW1.6
  Bottom Layer w0.203: v1(88.23,47.21) 87.79,47.64 54.54,47.64 51.37,50.82 31.94,50.82 31.53,51.22 31.13,51.22 30.73,50.82 U1.8
FN12: length 13.6
  Top Layer w0.203: 12.61,51.46 13.98,52.83 19.77,52.83 19.77,52.83 20.23,52.83 20.24,52.83 21.17,52.83 ; 12.6,51.42 12.6,49.04
  Bottom Layer w0.203: v1(21.17,52.83) 21.28,52.83 22.09,52.02 U1.38
  vias: v1(50.6,5.61)
G: length 55.6
  Top Layer w0.203: 17.97,46.47 17.97,47 18.27,47.3 21.17,47.3 21.72,47.85
  Inner2 w0.254: v1(77.38,5.57) v1(86.33,5.57) 90.82,10.05 v1(90.82,13.57) 95.32,18.07 v1(95.32,21.57) 90.82,26.07 v1(90.82,29.57) 90.82,35.19 93.2,37.57 v1(95.27,37.57)
  Bottom Layer w0.203: v1(21.81,47.92) 21.91,47.92 22.41,48.42 U1.29
GP2: length 1.8
  Bottom Layer w0.254: v1(4.46,61.42) 4.4,61.42 U61.11
GP3: length 1.6
  Bottom Layer w0.254: v1(4.79,70.27) 4.77,70.28 U61.8
GP4: length 128.6
  Top Layer w0.254: v1(35.05,62.23) 32.6,64.68 7,64.68 v1(5.42,66.26)
  Inner2 w0.254: U61.17 82,68.13 82,51.91 80.35,50.25 ; 80.35,50.25 42.89,50.25 35.05,58.09 v1(35.05,62.23) ; 80.35,50.25 82.51,50.25 85.81,46.95 85.81,43.71
  Bottom Layer w0.254: U61.13 3.99,57.58 5.42,59.02 v1(5.42,66.26) 3.94,67.74 U61.9
GP5: length 35.7
  Top Layer w0.254: 83.27,43.71 83.27,47.97 87.08,51.78 87.08,74.51 86.23,75.36 84.16,75.36
GP6: length 123.4
  Top Layer w0.254: v1(79.72,46.32) 84.54,51.14 84.54,67.35 U61.18 ; v1(66.76,46.83) 59.02,54.57 47.84,54.57 30.19,72.22 5.37,72.22 v1(4.79,72.81)
  Inner2 w0.254: v1(66.76,46.83) 77.43,46.83 78.19,46.06 78.19,44.79 ; v1(79.72,46.32) 78.19,44.79 ; 78.19,44.79 78.19,43.71
  Bottom Layer w0.254: U61.10 1.61,66.74 1.61,71.84 2.59,72.82 4.78,72.82 v1(4.79,72.81)
GP7: length 135.9
  Top Layer w0.254: 84.16,72.82 82.22,72.82 79.46,70.07 79.46,59.27 76.03,55.84 66.76,55.84 ; v1(4.82,75.33) 29.75,75.33 49.24,55.84 66.76,55.84 ; 66.76,55.84 75.65,46.95 75.65,43.71
  Bottom Layer w0.254: 3.15,75.36 3.18,75.33 v1(4.82,75.33) ; 3.06,75.28 2.37,75.28 0.96,73.87 0.96,61.54 2.8,59.7
GP12: length 61.8
  Top Layer w0.254: 2.GP12 60.41,44.9 54.55,50.76 44.64,50.76 40.35,55.05 v1(4.97,55.05)
  Bottom Layer w0.254: v1(4.97,55.05) 4.95,55.04 U61.14
GP13: length 76.3
  Top Layer w0.254: v1(4.92,82.89) 27.27,82.89 51.65,58.51 v1(53.56,58.51)
  Inner1 w0.254: 2.GP13 57.87,54.19 v1(53.56,58.51)
  Bottom Layer w0.254: v1(4.92,82.89) 3.24,82.89 3.15,82.98
GP14: length 72.5
  Top Layer w0.254: v1(4.89,80.45) 28.31,80.45 51.27,57.49 v1(53.05,57.49)
  Inner1 w0.254: 2.GP14 53.05,44.79 v1(53.05,57.49)
  Bottom Layer w0.254: 3.15,80.44 4.88,80.44 v1(4.89,80.45)
GP15: length 70.8
  Top Layer w0.254: v1(52.16,56.73) 50.76,56.73 29.55,77.94 v1(4.79,77.94)
  Inner1 w0.254: 2.GP15 52.16,46.44 v1(52.16,56.73)
  Bottom Layer w0.254: v1(4.79,77.94) 4.75,77.9 3.15,77.9
H: length 7
  Top Layer w0.203: 17.46,46.49 17.46,47.49 18.12,48.15 21.02,48.15
  Bottom Layer w0.203: U1.30 22.27,48.82 21.93,48.48 21.32,48.48 v1(21.04,48.2)
IO_SCL: length 47.4
  Top Layer w0.254: v1(33.24,52.97) 36.74,52.97 48.35,41.36 69.56,41.36 70.57,42.38 70.57,43.71
  Bottom Layer w0.203: v1(33.24,52.97) 30.37,52.97 30.21,52.82 U1.3
IO_SDA: length 48.3
  Inner2 w0.254: v1(31.46,53.56) 32.99,53.56 32.99,53.56 33.48,53.56 33.48,53.56 38.32,53.56 45.94,45.94 72.22,45.94 73.11,45.05 73.11,43.71
  Bottom Layer w0.203: U1.2 30.18,53.22 30.52,53.56 v1(31.46,53.56)
PWSW: length 26.9
  Inner1 w0.254: 22.03,53.13 17.74,57.42 17.74,65.94 19.98,68.18 24.82,68.18 25.62,68.98 v1(25.62,69.66)
  Bottom Layer w0.203: U1.41 22.24,53.22 v1(22.06,53.03)
  Bottom Layer w0.254: 25.63,69.67 25.63,71.11 25.69,71.17
QSPI_SCLK: length 6.3
  Bottom Layer w0.203: U1.52 27.4,54.44 27.4,55.39 28.88,56.87 29.82,56.87 30.59,57.63 U5.6
QSPI_SD0: length 5.3
  Bottom Layer w0.203: U5.5 28.88,56.36 27.78,55.26 U1.53
QSPI_SD1: length 16
  Bottom Layer w0.203: U5.2 39.93,58.9 40.31,58.52 40.31,57.38 39.96,57.03 37.17,57.03 35.48,55.34 29.02,55.34 28.58,54.9 U1.55
QSPI_SD2: length 12.4
  Bottom Layer w0.203: U1.54 28.18,54.97 28.93,55.73 35.23,55.73 37.13,57.63 U5.3
QSPI_SD3: length 7.3
  Bottom Layer w0.203: U5.7 30.4,58.9 26.98,55.48 U1.51
QSPI_SS: length 22.7
  Bottom Layer w0.203: U5.1 40.18,60.17 40.82,59.54 40.82,55.73 40.05,54.96 29.52,54.96 U1.56
  Bottom Layer w0.254: U5.1 38.88,61.09 38.53,61.44 R5.2 R16.2
USB_D+: length 4.7
  Bottom Layer w0.254: USB3.3 25.85,86.69 25.23,86.07 25.23,84.53 CN6.2
USB_D-: length 4.4
  Bottom Layer w0.254: USB3.2 23.97,88.79 CN6.3
USB_DN: length 24.6
  Inner2 w0.254: v1(7.84,47.71) 7.94,47.71 v1(21.65,61.43)
  Bottom Layer w0.203: 7.1,47.23 7.36,47.23 v1(7.84,47.71) ; 7.1,47.23 7.1,47.69 6.83,47.97 6.28,47.97 USB1.7 ; 7.1,47.23 6.82,46.95 6.29,46.95 USB1.5
  Bottom Layer w0.254: 21.65,63.22 21.65,63.21 v1(21.65,61.43)
USB_DP: length 29
  Inner2 w0.254: v1(5.07,46.99) 5.71,46.99 20.79,62.06 v1(20.79,64.1)
  Bottom Layer w0.203: USB1.8 6.26,48.48 5.69,48.48 5.44,48.23 ; 5.44,48.23 5.44,47.7 5.68,47.46 USB1.6 ; 5.44,48.23 5.07,47.85 v1(5.07,46.99)
  Bottom Layer w0.254: v1(20.79,64.1) 21.65,64.95 21.65,65
VOUT: length 58.6
  Inner2 w0.457: v1(56.6,67.4) 55.46,66.26 17.23,66.26 v1(16.09,67.4)
  Bottom Layer w0.457: C35.2 57.36,68.15 v1(56.6,67.4) ; v1(16.09,67.4) 16.09,69.75
  Bottom Layer w0.508: C30.2 16.23,69.89 R8.2 15.7,72.62 15.7,74.89
  Bottom Layer w0.635: U59.8 C33.2 C34.2 C35.2
VSYS: length 81.9
  Inner2 w0.457: v1(62.19,73.11) 62.19,71.46 61.43,70.7 58,70.7 56.35,72.35 v1(43.9,72.35)
  Bottom Layer w0.457: C38.1 61.37,73.94 v1(62.19,73.11) ; D1.1 14.95,46.4 14.95,64.86 19.01,68.92 38.57,68.92 42,72.35 v1(43.9,72.35)
  Bottom Layer w0.508: C38.1 60.54,74.07 60.54,75.77 60.53,75.78 R10.2 62.06,75.91 62.32,76.16 63.58,76.16 U59.1
XIN: length 7.7
  Bottom Layer w0.254: U1.20 26.98,46.96 28.37,45.57 29.96,45.57 30.97,46.58 30.97,44.53 X1.1
XOUT: length 3.7
  Bottom Layer w0.254: U1.21 26.58,46.72 28.5,44.8 R6.2
$1N3931: length 11.5
  Bottom Layer w0.254: U1.47 25.39,54.43 25.39,56.04 24.94,56.49 24.94,63.21 R3.1
$1N3933: length 9.6
  Bottom Layer w0.254: R4.1 23.28,63.22 24.43,62.07 24.43,56.36 24.98,55.81 U1.46
$1N4882: length 2.3
  Bottom Layer w0.254: X1.3 33.3,42.96 C29.2
$1N5098: length 8.4
  Bottom Layer w0.254: U1.26 24.58,46.85 23.8,46.07 20.56,46.07 R15.1 19.99,46.54 TP1.1
$1N34793: length 2.1
  Bottom Layer w0.508: C31.2 59.03,74.2 R10.1
$1N35302: length 14.2
  Bottom Layer w0.635: U59.6 66.13,69.18 67.02,68.29 69.94,68.29 70.88,69.23 70.88,72.53 71.84,73.5 C36.2 72.87,73.57 R11.1
$1N35309: length 10.6
  Bottom Layer w0.635: L1.1 71.51,67.27 66.64,67.27 64.86,69.05 U59.7
$1N35479: length 2
  Bottom Layer w0.508: R12.2 69.43,70.33 U59.5
$1N35483: length 3.6
  Bottom Layer w0.508: R12.1 69.69,72.09 69.69,74.38 TP3.1
$1N35763: length 9.9
  Bottom Layer w0.508: C30.1 17.55,71.92 R8.1 Q1.3 19.66,75.58 D3.2 18.06,75.78 Q2.1
$1N35788: length 6.6
  Bottom Layer w0.508: D2.2 27.56,72.1 26.37,72.1 R7.2 R9.2 21.86,72.85 Q1.1
$1N40183: length 34.5
  Top Layer w0.305: v1(11.77,96.99) 11.73,97.03 SW2.4
  Inner2 w0.305: v1(11.77,96.99) 17.36,91.4 17.36,79.34 18,78.7 v1(21.55,78.7)
  Bottom Layer w0.305: v1(21.55,78.7) 23.24,77.01 D3.1 23.33,75.7 D2.1
$1N52045: length 6.9
  Bottom Layer w0.508: C39.2 53.43,75.21 U62.5
  Bottom Layer w0.635: C39.2 52.73,75.91 49.55,75.91 L2.1
$1N52049: length 2
  Bottom Layer w0.508: U62.6 54.38,75.65 54.38,75.65
$1N56161: length 7.9
  Bottom Layer w0.203: TP4.1 19.99,42.39 20.75,43.15 21.51,43.15 24.98,46.62 U1.25
$1N63771: length 6.7
  Bottom Layer w0.203: TP2.1 22.27,43.28 25.36,46.36 25.36,47.59 U1.24
